# Altium schematic sheet LED_Point.SchDoc
size A; DocumentNumber: 8; SheetNumber: 9; SheetTotal: 9
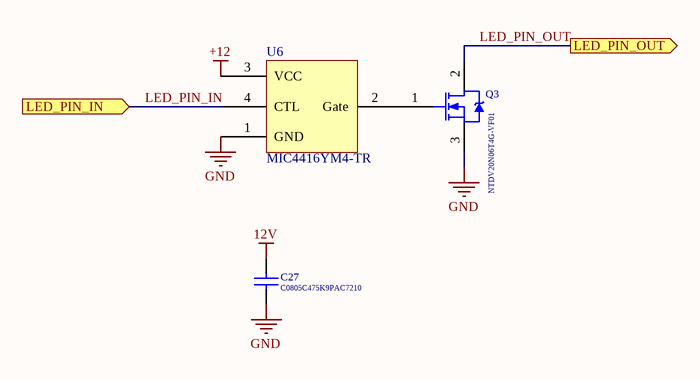
[diagram p0: LED_Point.SchDoc]

## Parts
C27  C0805C475K9PAC7210  [CAP SMD 0805]
Q3  NTDV20N06T4G-VF01  [DPAK228P991X238-3N]
U6  MIC4416YM4-TR  [MICROCHIP SOT-143-4]

## Ports
LED_PIN_IN (in), LED_PIN_OUT (out)

## Nets
12V: C27.2
+12: U6.3(VCC)
GND: C27.1 Q3.3(S) U6.1(GND)
LED_PIN_IN: U6.4(CTL) ; port LED_PIN_IN
LED_PIN_OUT: Q3.2(D) ; port LED_PIN_OUT
NetQ3_1: Q3.1(G) U6.2(Gate)

## Library data of the parts
C27 = Cap_3_1: 4.7 µF ±10% 6.3V Ceramic Capacitor X5R 0805 (2012 Metric); Value: 0.1uF; Published: 8-Jun-2000; LatestRevisionDate: 17-Jul-2002; LatestRevisionNote: Re-released for DXP Platform.; PackageReference: RAD-0.3; Publisher: Altium Limited; PackageDescription: Radial Cap, Thru-Hole; 2 Leads; 0.3 in Pin Spacing
Q3 = IRF540NS: MOSFET N-CH 60V 20A DPAK; Manufacture: ON Semiconductor; Manufacture Part Number: IRF540N_R4942; Published: 8-Jun-2000; LatestRevisionDate: 20-Nov-2009; LatestRevisionNote: IPC-7351 Footprint Added.; DatasheetVersion: May-1998; PackageReference: TO-220AB; Publisher: Altium Limited; PackageDescription: TO, Thru-Hole, Vertical, Heatsink Mounted; 3 In-Line Leads; Pitch 2.54 mm; ComponentLink1Description: Manufacturer Link; ComponentLink1URL: http://www.irf.com/; ComponentLink2Description: Datasheet; ComponentLink2URL: http://www.irf.com/product-info/datasheets/data/irf540ns.pdf; Supplier: Local; Supplier Part Number: IRF540N
U6 = MIC4416YM4-TR: IC GATE DRVR LOW-SIDE SOT143; Manufacturer: Microchip Technology; Channel Type: Single; Current - Peak Output (Source, Sink): 1.2A, 1.2A; Gate Type: N-Channel MOSFET; Input Type: Non-Inverting; Logic Voltage - VIL, VIH: 0.8V, 2.4V; Number of Drivers: 1; Rise / Fall Time (Typ): 14ns, 16ns; Voltage - Supply: 4.5V ~ 18V; Part Number: MIC4416YM4-TR; ComponentLink1Description: Datasheet; ComponentLink1URL: http://www.microchip.com/mymicrochip/filehandler.aspx?ddocname=en579163; ComponentLink2Description: DigiKey Link; ComponentLink2URL: http://digikey.com/product-detail/en/microchip-technology/MIC4416YM4-TR/576-1187-1-ND/771864; Device Package: TO-253-4, TO-253AA; Driven Configuration: Low-Side; LastUpdated: 31/01/2020 01:32:45; Lifecycle Status: Active; Minimum Order: 1; Mounting Type: Surface Mount; Operating Temperature: -40°C ~ 150°C (TJ); Package / Case: TO-253-4, TO-253AA; Packaging: TapeAndReel; PartId: 7; Part Status: Active; Price: 0.68; Series: IttyBitty®; Supplier 1: DigiKey; Supplier Part Number 1: 576-1187-1-ND; Supplier Device Package: SOT-143